# EAGLE design ir2109 (EAGLE 7.6.0)
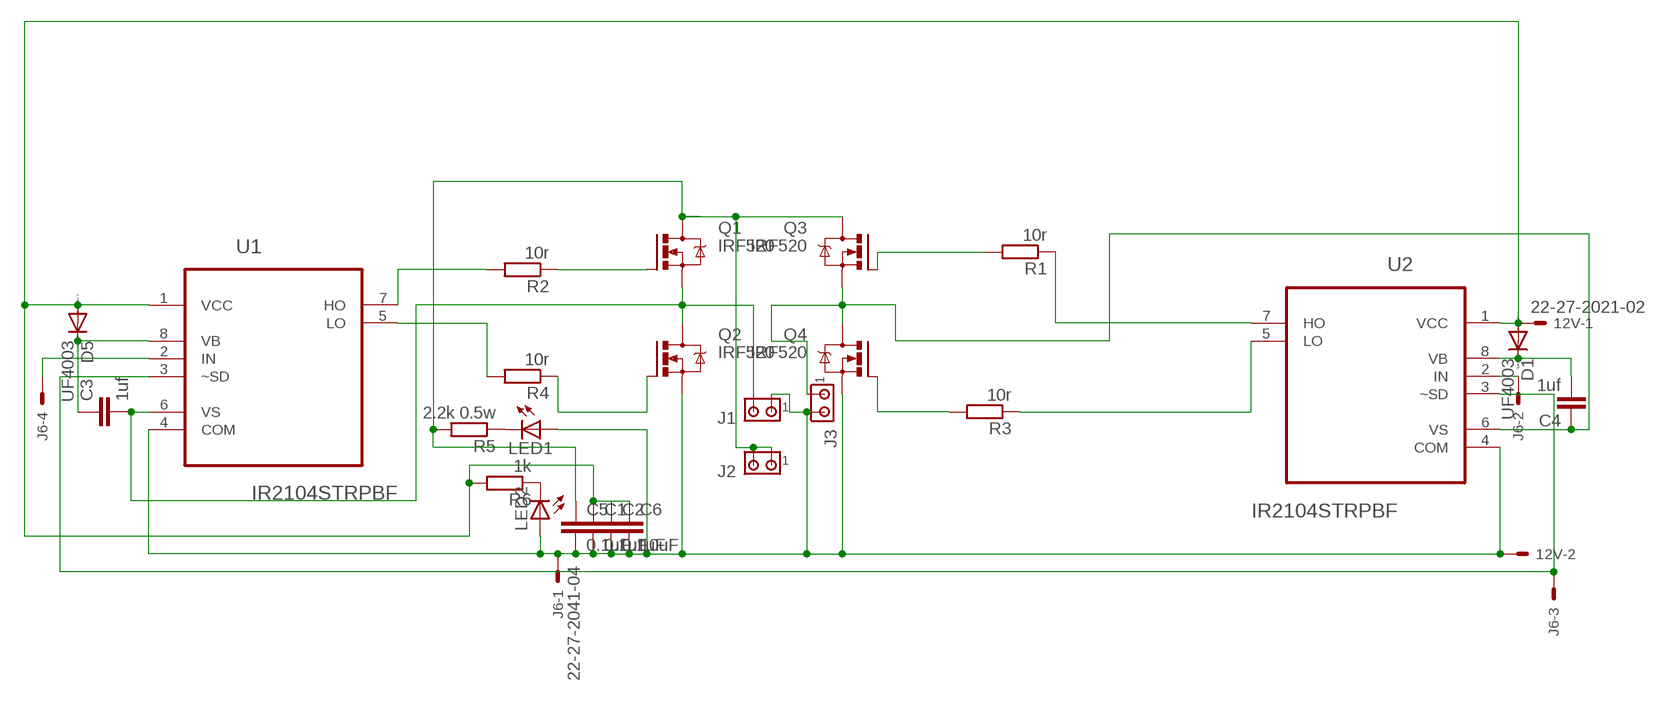
[diagram p0: schematic, sheet 1]

## Parts
12V  22-27-2021-02  [6410-02]
C1  0.1uF  C-EUC0805  [C0805]
C2  0.1uF  C-EUC0805  [C0805]
C3  1uf  C-EUC0805  [C0805]
C4  1uf  C-EUC0805  [C0805]
C5  0.1uF  C-EUC0805  [C0805]
C6  10uF  C5/7.2  [C5B7.2]
D1  UF4003  [DO41-10]
D5  UF4003  [DO41-10]
J1  MTA02-156  [1X2MTA]
J2  MTA02-156  [1X2MTA]
J3  MTA02-156  [1X2MTA]
J6  22-27-2041-04  [6410-04]
LED1  LEDCHIP-LED0603  [CHIP-LED0603]
LED2  LEDCHIP-LED0603  [CHIP-LED0603]
Q1  IRF520  [TO220BV]
Q2  IRF520  [TO220BV]
Q3  IRF520  [TO220BV]
Q4  IRF520  [TO220BV]
R1  10r  R-EU_R0805  [R0805]
R2  10r  R-EU_R0805  [R0805]
R3  10r  R-EU_R0805  [R0805]
R4  10r  R-EU_R0805  [R0805]
R5  2.2k 0.5w  R-EU_R1210  [R1210]
R6  1k  R-EU_R0805  [R0805]
U1  IR2104STRPBF  [SOIC127P600X175-8N]
U2  IR2104STRPBF  [SOIC127P600X175-8N]

## Nets
12V: 12V.1 C1.1 C2.1 C6.1 D1.A D5.A R6.2 U1.1(VCC) U2.1(VCC)
24V: C5.1 J2.1 J2.2 Q1.D Q3.D R5.2
GND: 12V.2 C1.2 C2.2 C5.2 C6.2 J1.1 J3.2 J6.1 LED1.A LED2.A Q2.S Q4.S U1.4(COM) U2.4(COM)
HO1: R2.2 U1.7(HO)
HO2: R1.1 U2.7(HO)
IN1: J6.4 U1.2(IN)
IN2: J6.2 U2.2(IN)
LO1: R4.2 U1.5(LO)
LO2: R3.1 U2.5(LO)
M1: C3.2 J1.2 Q1.S Q2.D U1.6(VS)
M2: C4.1 J3.1 Q3.S Q4.D U2.6(VS)
N$1: Q3.G R1.2
N$9: Q2.G R4.1
N$10: Q1.G R2.1
N$13: C3.1 D5.C U1.8(VB)
N$14: LED1.C R5.1
N$15: Q4.G R3.2
N$16: LED2.C R6.1
N$19: C4.2 D1.C U2.8(VB)
SD: J6.3 U1.3(~SD) U2.3(~SD)

## Library data of the parts
12V = con-molex:22-?-02: CONNECTOR wire to board 2.54 mm (.1 inch) pitch header; OC_FARNELL: unknown; OC_NEWARK: unknown
C1-C5 = resistor:C-EU: CAPACITOR, European symbol
C6 = capacitor-wima:C: CAPACITOR naming: grid - package width
D1 D5 = diode:UF4003: DIODE ultrafast recovery diode, 200 V rectifier
J1-J3 = con-amp:MTA02-156: AMP connector
J6 = con-molex:22-?-04: CONNECTOR wire to board 2.54 mm (.1 inch) pitch header; OC_FARNELL: unknown; OC_NEWARK: unknown
LED1 LED2 = led:LED: LED OSRAM: - CHIPLED LG R971, LG N971, LY N971, LG Q971, LY Q971, LO R971, LY R971 LH N974, LH R974 LS Q976, LO Q976, LY Q976 LO Q996 - Hyper CHIPLED LW Q18S LB Q993, LB Q99A, LB R99A - SideLED LS A670, LO A670, LY A670, LG A670, LP A670 LB A673, LV A673, LT A673, LW A673 LH A674 LY A675 LS A676, LA A676, LO A676, LY A676, LW A676 LS A679, LY A679, LG A679 - Hyper Micro SIDELED® LS Y876, LA Y876, LO Y876, LY Y876 LT Y87S - SmartLED LW L88C, LW L88S LB L89C, LB L89S, LG L890 LS L89K, LO L89K, LY L89K LS L896, LA L896, LO L896, LY L896 - TOPLED LS T670, LO T670, LY T670, LG T670, LP T670 LSG T670, LSP T670, LSY T670, LOP T670, LYG T670 LG T671, LOG T671, LSG T671 LB T673, LV T673, LT T673, LW T673 LH T674 LS T676, LA T676, LO T676, LY T676, LB T676, LH T676, LSB T676, LW T676 LB T67C, LV T67C, LT T67C, LS T67K, LO T67K, LY T67K, LW E67C LS E67B, LA E67B, LO E67B, LY E67B, LB E67C, LV E67C, LT E67C LW T67C LS T679, LY T679, LG T679 LS T770, LO T770, LY T770, LG T770, LP T770 LB T773, LV T773, LT T773, LW T773 LH T774 LS E675, LA E675, LY E675, LS T675 LS T776, LA T776, LO T776, LY T776, LB T776 LHGB T686 LT T68C, LB T68C - Hyper Mini TOPLED® LB M676 - Mini TOPLED Santana® LG M470 LS M47K, LO M47K, LY M47K Source: http://www.osram.convergy.de LUXEON: - LUMILED® LXK2-PW12-R00, LXK2-PW12-S00, LXK2-PW14-U00, LXK2-PW14-V00 LXK2-PM12-R00, LXK2-PM12-S00, LXK2-PM14-U00 LXK2-PE12-Q00, LXK2-PE12-R00, LXK2-PE12-S00, LXK2-PE14-T00, LXK2-PE14-U00 LXK2-PB12-K00, LXK2-PB12-L00, LXK2-PB12-M00, LXK2-PB14-N00, LXK2-PB14-P00, LXK2-PB14-Q00 LXK2-PR12-L00, LXK2-PR12-M00, LXK2-PR14-Q00, LXK2-PR14-R00 LXK2-PD12-Q00, LXK2-PD12-R00, LXK2-PD12-S00 LXK2-PH12-R00, LXK2-PH12-S00 LXK2-PL12-P00, LXK2-PL12-Q00, LXK2-PL12-R00 Source: www.luxeon.com KINGBRIGHT: KA-3528ASYC Source: www.kingbright.com
Q1-Q4 = transistor-power:IRF520: HEXFET Power MOSFET
R1-R6 = resistor:R-EU_: RESISTOR, European symbol
U1 U2 = ir:IR2104STRPBF: HALF-BRIDGE DRIVER; MPN: IR2104STRPBF; OC_FARNELL: 1795566; OC_NEWARK: 40M8006; PACKAGE: SOIC-8; SUPPLIER: INTERNATIONAL RECTIFIER

## Board
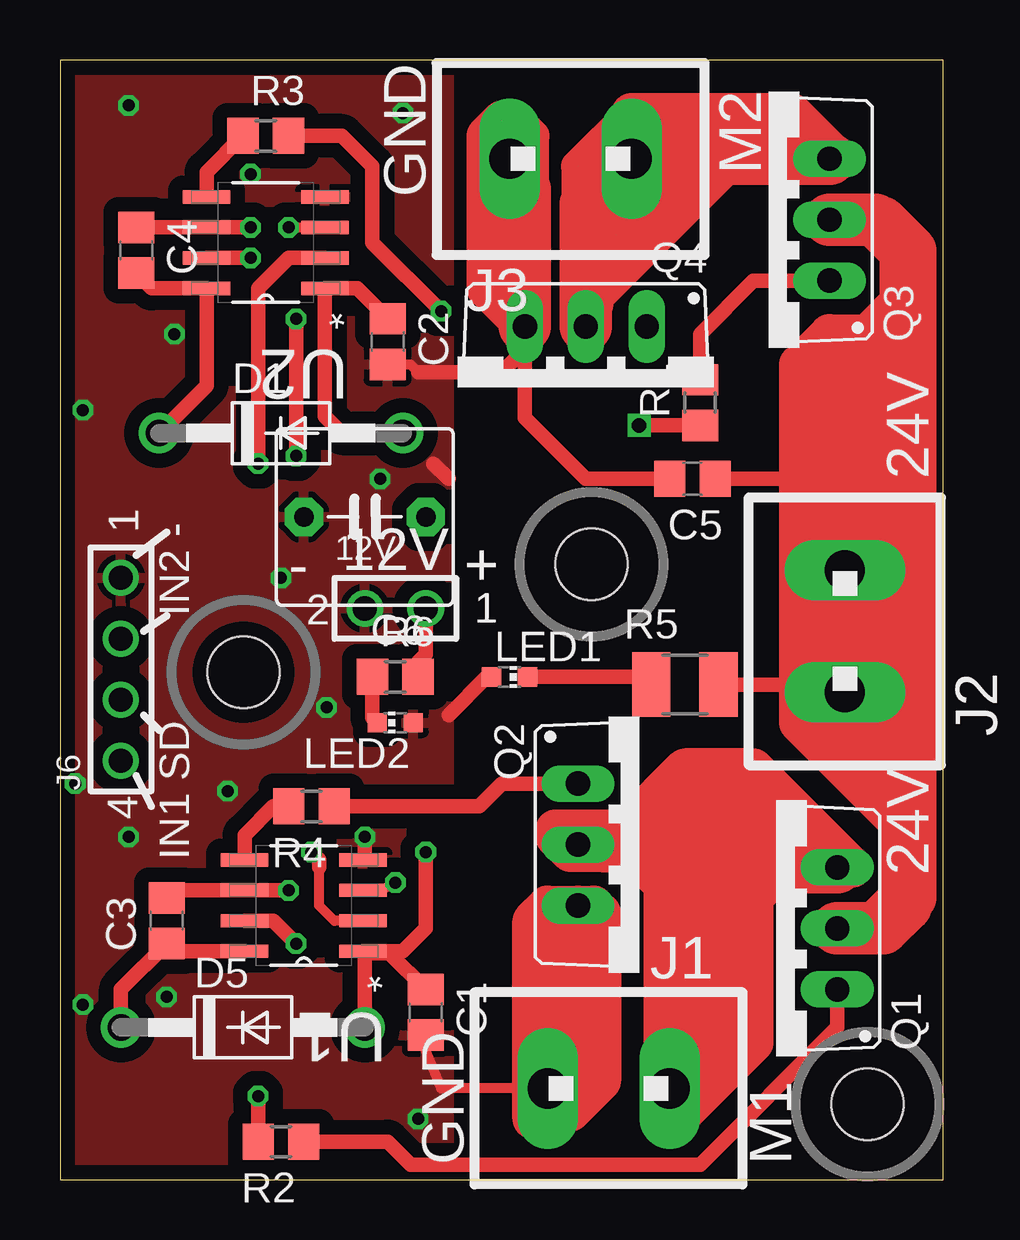
[diagram p1: board, top side]
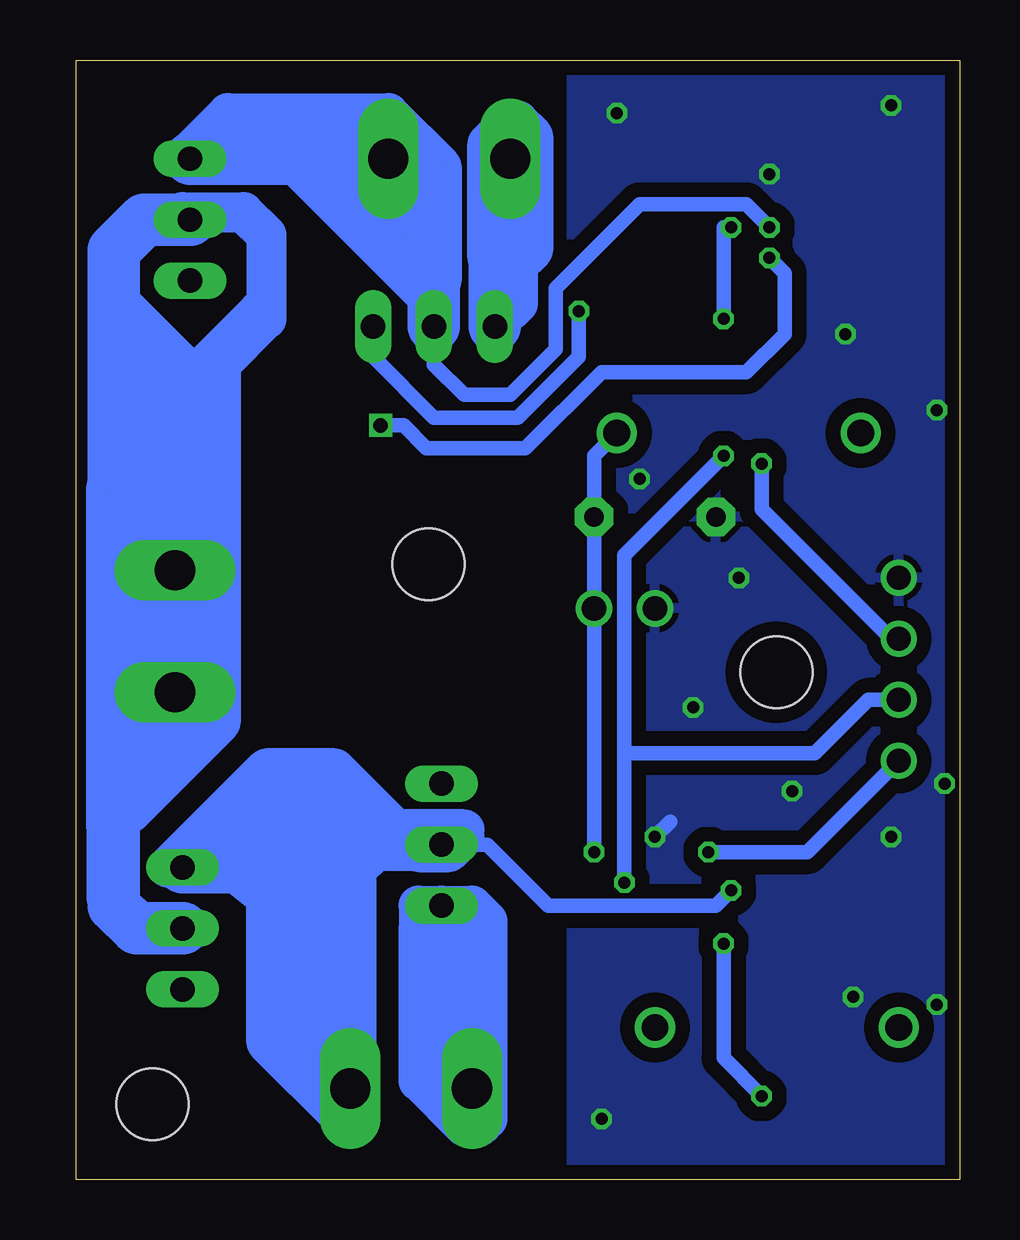
[diagram p2: board, bottom side, seen from below]

Size 36.81 x 46.66 mm. Coordinates in mm from the lower left corner, seen from the top.
Outline: 0,0 36.81,0 36.81,46.66 0,46.66 0,0
Copper layers (1*16): Top 0.0356mm / dielectric 1.5011mm / Bottom 0.0356mm
Design rules "LaenPCBOrder": minimum track width 6mil, minimum drill 13mil, track to track 6mil, track to pad 6mil, pad to pad 6mil, via to via 6mil, smd to smd 6mil, copper to edge 15mil, drill to drill 6mil, minimum pad ring 7mil, minimum via ring 7mil, stop-mask expansion 3mil, vias tented up to drill 20mil, thermal gap 10mil
Holes 3 mm at 22.14,25.65 7.64,21.15 33.64,3.15

### Footprints (pad centres in the part's own frame; a part is rotated, then mirrored left to right if it is on the bottom)
6410-02 = drill 1.016: 1 1.27,0; 2 -1.27,0
C0805 = smd 1.3 x 1.5: 1 -0.95,0; 2 0.95,0
C5B7.2 = drill 0.813 pad 1.6 octagon: 1 -2.54,0; 2 2.54,0
DO41-10 = drill 1.118: A 5.08,0; C -5.08,0
1X2MTA = drill 1.676 long: 1 2.54,0; 2 -2.54,0
6410-04 = drill 1: 1 3.81,0; 2 1.27,0; 3 -1.27,0; 4 -3.81,0
CHIP-LED0603 = smd 0.8 x 0.8: A 0,-0.75; C 0,0.75
TO220BV = drill 1.016 long: D 0,-2.54; G -2.54,-2.54; S 2.54,-2.54
R0805 = smd 1.3 x 1.5: 1 -0.95,0; 2 0.95,0
R1210 = smd 1.6 x 2.7: 1 -1.4,0; 2 1.4,0
SOIC127P600X175-8N = smd 1.981 x 0.559: 1 -2.464,1.905; 2 -2.464,0.635; 3 -2.464,-0.635; 4 -2.464,-1.905; 5 2.464,-1.905; 6 2.464,-0.635; 7 2.464,0.635; 8 2.464,1.905

### Placement (x,y rotation side)
12V  13.97,23.81 0 top
C1  15.24,6.99 270 top
C2  13.65,34.92 270 top
C3  4.45,10.79 90 top
C4  3.17,38.73 270 top
C5  26.35,29.21 180 top
C6  12.7,27.62 180 top
D1  9.21,31.12 0 top
D5  7.62,6.35 0 top
J1  22.86,3.81 180 top
J2  32.7,22.86 90 top
J3  21.27,42.55 0 top
J6  2.54,21.27 90 top
LED1  18.73,20.95 270 top
LED2  13.97,19.05 90 top
Q1  29.84,10.48 90 top
Q2  24.13,13.97 270 top
Q3  29.53,40 90 top
Q4  21.91,33.02 180 top
R1  26.67,32.38 90 top
R2  9.21,1.59 180 top
R3  8.57,43.5 0 top
R4  10.48,15.56 180 top
R5  26.03,20.64 0 top
R6  13.97,20.95 0 top
U1  10.16,11.43 180 top
U2  8.57,39.05 180 top

### Tracks (layer width: path | path; a pad name or v marks a point on that pad's centre or on a via)
12V  (via drill 0.5)
  Top 0.61: D5.A 12.7,9.45 | 12.7,9.45 U1.1 14.29,9.53 15.24,10.48 v15.24,13.65 | 12.7,9.45 13.73,9.45 C1.1 | C2.1 12.38,37.15 U2.1 11.04,31.83 11.75,31.12 D1.A | R6.2 14.92,21.59 15.24,21.91 12V.1
  Bottom 0.61: v15.24,13.65 12V.1 C6.1 15.24,30.16 D1.A
24V  (1 unrouted)
  Top 0.61: R5.2 32.38,20.64 J2.2 | C5.1 31.75,29.21 32.07,29.53
  Top 1.676: 32.7,25.72 32.7,34.29 33.34,34.92 | 33.34,34.92 33.66,35.24 | 33.66,35.24 35.24,36.83 35.24,35.56 33.97,34.29 33.97,28.57 33.66,28.26 | 35.24,14.92 34.92,14.92 32.38,17.46 | 32.38,17.46 32.38,18.73 | 32.38,20.64 32.38,18.73 | 32.38,18.73 33.97,17.15 | 32.38,17.46 30.8,19.05 30.8,32.07 | 33.34,34.92 33.34,34.29 31.43,32.38 32.07,32.38 32.07,29.53 32.07,26.67 31.43,26.03 | 35.24,13.97 35.24,12.06 33.66,10.48 | 31.75,33.66 31.75,33.02 30.8,32.07 | 35.56,28.57 35.56,17.78 33.97,19.37 33.97,25.4 34.29,25.72 | 30.8,32.07 30.8,33.97 32.07,35.24 33.66,35.24
  Top 1.93: 33.02,10.48 34.29,10.48 35.56,11.75 35.56,38.73 34.29,40
  Top 2.184: Q1.D 33.02,10.48 33.66,10.48 34.29,10.48 35.24,11.43 35.24,13.97 35.24,14.92 35.24,17.78 J2.2 J2.1 35.24,27.94 35.24,36.83 35.24,38.73 33.97,40 Q3.D
  Bottom 1.676: 32.7,40 32.38,40.32 29.85,40.32 28.89,39.37 28.89,35.88 30.8,33.97 30.8,19.05 34.61,15.24 34.61,17.15 32.38,19.37 32.38,33.02 32.07,33.34 | 29.21,36.2 32.07,33.34 | 32.07,33.34 32.07,33.66 34.92,36.51 34.92,35.24 33.66,33.97 33.66,16.51 35.56,14.6 | 35.56,14.6 35.56,11.75 | 35.56,14.6 35.56,28.57 35.56,28.89 34.92,29.53 34.92,19.05
  Bottom 2.184: Q3.D 32.7,40 33.97,40 35.24,38.73 35.24,27.94 J2.1 J2.2 35.24,17.78 35.24,11.43 34.29,10.48 Q1.D
GND  (via drill 0.5)  (1 unrouted)
  Top 0.406: J1.1 15.88,3.81 15.24,5.4 C1.2 | C2.2 14.6,33.98 14.92,33.66
  Top 0.61: U1.4 12.7,13.33 v12.7,14.29 | 14.92,33.66 18.42,33.66 19.37,34.61 Q4.S 19.37,31.75 21.91,29.21 C5.2 | LED1.A 17.78,20.95 16.19,19.37 | 16.19,29.21 15.56,29.84
  Top 1.676: 21.59,8.57 Q2.S | 19.37,36.2 19.37,37.46 18.1,38.73 18.1,43.81 | 18.1,43.81 18.42,44.13 | Q4.S 17.78,37.15 17.78,43.5 18.1,43.81
  Top 2.184: J1.1 20.32,7.3 21.59,8.57 | Q4.S 19.37,36.2 19.37,41.27 J3.2
  Bottom 0.61: v12.7,14.29 12.06,14.92
  Bottom 1.676: Q2.S 21.59,8.57 | 20.32,2.22 20.64,2.22 22.54,4.13 22.54,10.48 Q2.S | Q2.S 20.32,11.43 19.69,10.79 19.69,2.54 20,2.22 | 19.69,38.42 19.69,43.18 18.73,44.13 18.42,44.13 17.78,43.5 17.78,38.73 18.42,38.1 18.42,36.51 18.73,36.2
  Bottom 2.184: Q4.S 19.37,41.91 J3.2 | 21.59,8.57 20.32,7.3 J1.1
  other vias: 0.95,32.07 0.64,16.51 11.11,19.69 13.33,29.21 7.94,41.91 2.86,44.77 14.29,44.45 4.76,35.24 9.21,25.08 4.45,7.62 14.92,2.54 0.95,7.3 2.86,14.29 6.98,16.19
  pour Bottom (isolate 0.61): 0.32,46.35 16.19,46.35 16.19,0.64 0.32,0.64
  pour Top (isolate 0.61): 0.32,46.35 16.19,46.35 16.19,0.64 0.32,0.64
HO1  (via drill 0.5)
  Top 0.61: U1.7 8.89,10.79 v9.84,9.84 | v8.26,3.49 R2.2
  Bottom 0.61: v9.84,9.84 9.84,5.08 v8.26,3.49
HO2  (via drill 0.5, 0.6)
  Top 0.61: R1.1 v24.13,31.43 | v7.94,38.42 U2.7
  Bottom 0.61: v24.13,31.43 23.18,31.43 22.22,30.48 18.1,30.48 14.92,33.66 8.89,33.66 7.3,35.24 7.3,37.78 v7.94,38.42
IN1  (via drill 0.5)
  Top 0.406: U1.2 11.43,10.79 10.79,11.43 10.79,13.02
  Top 0.61: 10.79,13.02 10.79,13.33 v10.48,13.65
  Bottom 0.61: v10.48,13.65 6.35,13.65 J6.4
IN2  (via drill 0.5)
  Top 0.61: v8.26,29.84 8.26,37.15 9.53,38.42 U2.2
  Bottom 0.61: J6.2 2.86,22.54 8.26,27.94 v8.26,29.84
LO1
  Top 0.61: U1.5 7.7,14.36 8.89,15.56 R4.2
LO2
  Top 0.61: U2.5 6.11,41.98 R3.1
M1  (via drill 0.5)  (1 unrouted)
  Top 0.61: v9.53,12.06 U1.6 4.76,12.06 C3.2
  Top 1.676: J1.2 26.35,3.81 26.99,4.45 26.99,9.84 27.62,10.48 | 28.89,11.75 30.48,13.33 29.21,13.33 26.67,10.79 | 32.07,13.02 32.07,13.97 28.89,17.15 26.03,17.15 23.81,14.92 25.72,14.92 26.67,15.88 28.89,15.88 29.21,15.56 | 26.99,4.13 27.62,4.76 27.62,10.48 | 27.62,10.48 28.89,11.75 | 28.89,11.75 28.89,5.71 25.72,2.54 | 20.64,14.6 31.43,14.6 33.02,13.02
  Top 2.184: Q2.D 24.45,13.97 25.4,13.02 | J1.2 25.4,13.02 | Q1.S 32.07,13.02 25.4,13.02
  Bottom 0.61: v9.53,12.06 10.16,11.43 17.15,11.43 19.69,13.97 Q2.D
  Bottom 1.676: 22.54,13.65 21.27,13.65 20.64,14.29 20.64,14.6 23.49,14.6 26.03,17.15 28.89,17.15 33.02,13.02 Q1.S 31.43,13.02 28.58,15.88 27.31,15.88 26.35,14.92 | 26.35,14.92 25.72,14.92 25.72,15.24 26.35,15.88 26.35,14.92 | 26.35,14.92 27.31,13.97 27.62,13.97 27.94,14.29 28.89,14.29 30.48,13.02 28.89,11.75 | 28.89,11.75 27.31,10.16 27.31,4.76 26.03,3.49 26.03,10.48 27.31,11.75 | 25.72,2.54 28.89,5.71 28.89,11.75
  Bottom 2.184: Q1.S 30.48,13.02 25.4,13.02 24.45,13.97 Q2.D | J1.2 25.4,12.7
M2  (via drill 0.5)  (2 unrouted)
  Top 0.61: C4.1 4.76,39.69 U2.6 v7.94,39.69
  Top 1.422: 23.81,44.45 21.59,42.23 21.59,40.64
  Top 1.676: 22.54,37.15 27.94,42.55 26.67,42.55 25.4,41.27 | 32.07,42.86 30.48,44.45 23.81,44.45 | 22.22,36.51 22.22,37.15 24.13,39.05 24.13,40.96 23.81,41.27 23.81,40 23.18,39.37
  Top 2.184: Q3.S 27.94,42.55 J3.1 21.91,40.64 Q4.D
  Bottom 0.61: v7.94,39.69 8.89,40.64 13.33,40.64 16.83,37.15 16.83,34.61 18.73,32.7 20.64,32.7 21.91,33.97 Q4.D
  Bottom 1.676: Q3.S 32.07,42.86 30.48,44.45 23.81,44.45 21.59,42.23 21.59,37.46 22.22,36.83 27.62,42.23 24.76,42.23 23.18,40.64 23.18,39.37 | 23.18,39.37 23.49,39.37 25.4,41.27 | 23.18,39.37 23.18,38.1 22.22,37.15
  Bottom 2.184: Q4.D 21.91,40.64 J3.1 Q3.S
N$1
  Top 0.61: Q3.G 28.89,37.46 26.67,35.24 R1.2
N$4
  Bottom 1.676: 22.54,11.43 20.32,11.43 20,11.11 20,4.45 21.27,3.18 21.59,3.49 | 21.59,3.49 22.22,4.13 | 22.22,4.13 22.22,11.11 22.54,11.43 | 22.54,11.43 22.54,4.45 22.22,4.13 | 21.59,3.49 21.59,7.62
N$9
  Top 0.61: R4.1 17.46,15.56 18.42,16.51 Q2.G
N$10
  Top 0.61: R2.1 13.65,1.59 14.6,0.64 26.67,0.64 32.38,6.35 Q1.G
N$12
  Top 1.676: 19.69,2.54 19.69,10.79 20.32,11.43 22.22,11.43 22.54,11.11 22.54,4.13 21.27,2.86 21.27,9.21 20.64,9.84
N$13
  Top 0.61: U1.8 4.76,9.53 C3.1 2.54,7.94 D5.C
N$14
  Top 0.61: LED1.C 24.32,20.95 R5.1
N$15  (via drill 0.5)
  Top 0.61: 9.62,43.6 R3.2 11.75,43.5 13.02,42.23 13.02,39.05 v15.88,36.2
  Bottom 0.61: Q4.G 24.45,34.29 21.91,31.75 18.42,31.75 15.88,34.29 v15.88,36.2
N$16
  Top 0.61: R6.1 13.02,19.25 LED2.C
N$19
  Top 0.61: D1.C 6.11,33.1 U2.8 3.81,37.15 C4.2
N$22
  Top 1.422: 19.69,40.96 19.69,43.5 19.05,44.13
N$23
  Top 1.676: 26.67,11.75 26.67,12.06 | 26.67,12.38 26.67,12.06 | 26.67,12.06 26.35,12.38
N$24
  Top 1.676: 22.54,13.65 21.27,13.65 20.64,14.29 21.91,14.29 22.54,13.65 | 22.54,13.65 23.81,13.65 25.08,12.38
SD  (via drill 0.5)
  Top 0.406: U1.3 13.33,12.06 v13.97,12.38 | v9.53,39.69 U2.3
  Top 0.61: v9.84,30.16 v9.84,35.88
  Bottom 0.406: 9.84,39.69 v9.53,39.69
  Bottom 0.61: v9.84,35.88 9.84,39.69 | v13.97,12.38 13.97,17.78 | 13.97,17.78 13.97,26.03 v9.84,30.16 | J6.3 3.81,20 6.03,17.78 13.97,17.78

### Text on the board
tNames: M2 | GND | 24V | 12V | - | + | IN2 - | IN1 SD | 24V | GND | M1